# Altium project workerBoard_recovered.PrjPcb
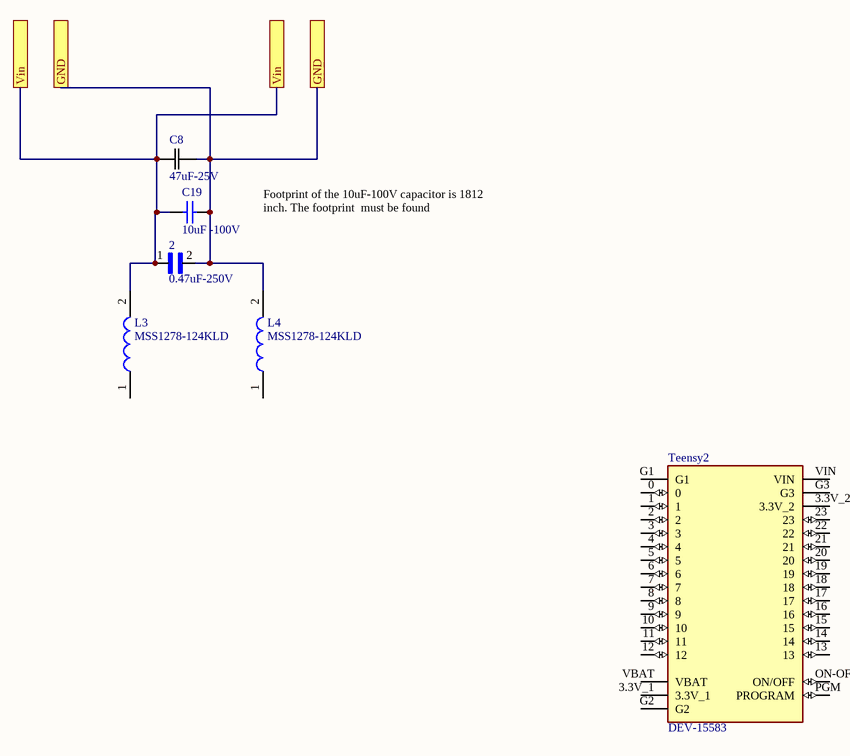
[diagram p0: masterUnit.SchDoc]
2 sheets, 11 parts. Net scope: flat (ports and power ports of the same name join across sheets).
Board files: ADC_RS_MCU.PcbDoc, accel.PcbDoc
Sheets:
  masterUnit.SchDoc
  thvd8000.SchDoc

## Sheet masterUnit.SchDoc
size A4; SheetNumber: 4; SheetTotal: 7

### Parts
2  0.47uF-250V  [CAPC3326X280N]
C8  47uF-25V
C19  value 10uF -100V  (hidden comment: Symbol)
L3  MSS1278-124KLD  [INDPM120120X805N]
L4  MSS1278-124KLD  [INDPM120120X805N]
Teensy2  DEV-15583  [MODULE_DEV-15583]

### Ports
GND, Vin

### Nets
GND: 2.2 C8.2 C19.2 L4.2 ; port GND
Vin: 2.1 C8.1 C19.1 L3.2 ; port Vin

Not connected (* = marked no-connect by the designer): L3 1; L4 1; Teensy2 0 1 2 3 3.3V_1 3.3V_2 4 5 6 7 8 9 10 11 12 13 14 15 16 17 18 19 20 21 22 23 G1 G2 G3 ON-OFF(ON/OFF) PGM(PROGRAM) VBAT VIN

### Notes on the sheet
- Footprint of the 10uF-100V capacitor is 1812 inch. The footprint  must be found

### Library data of the parts
2 = CMP-010-000002-1: MF: {'manufacturer': u'KEMET'}; MP: C1210X474KARACAUTO; Value: *; Package: None; Price: None; Availability: Unavailable; Component Type: Standard; Design Item ID: C1210X474KARACAUTO; Pin Count: 2; Source: workerBoard.SCHLIB
C8 = CMP-003-000007-1: No Description Available; Mfr_Name: Murata; Type: DEV; Copyright: Copyright (C) 2021 Ultra Librarian. All rights reserved.; Manufacturer_Part_Number: GRM31CR61E476ME44K; RefDes: RefDes; Component Type: Standard; Design Item ID: GRM31CR61E476ME44K; Pin Count: 2; Source: workerBoard.SCHLIB
C19 = CMP-003-000004-1: Capacitor; SimulationGenericComponent: True; Component Type: Standard; Design Item ID: Capacitor; Pin Count: 2; Source: workerBoard.SCHLIB
L3 L4 = CMP-006-000002-1: Inductor; Manufacturer_Name: COILCRAFT; Datasheet Link: https://componentsearchengine.com/Datasheets/1/MSS1278-124KLD.pdf; Height: 8.05mm; Manufacturer_Part_Number: MSS1278-124KLD; Component Type: Standard; Design Item ID: MSS1278-124KLD; Pin Count: 2; Source: workerBoard.SCHLIB
Teensy2 = CMP-010-000005-1: RT1062 Teensy 4.0 i.MX ARMÂ® CortexÂ®-M7 MPU Embedded Evaluation Board; MF: SparkFun Electronics; Pin Count: 33; Package: None; Digi-Key_Purchase_URL: https://www.digikey.com/product-detail/en/sparkfun-electronics/DEV-15583/1568-DEV-15583-ND/10384551?utm_source=snapeda&utm_medium=aggregator&utm_campaign=symbol; Design Item ID: DEV-15583; Component Type: Standard; MP: DEV-15583; Source: workerBoard.SCHLIB; SnapEDA_Link: https://www.snapeda.com/parts/DEV-15583/SparkFun%20Electronics/view-part/4001229/?ref=snap; Value: *; Digi-Key_Part_Number: 1568-DEV-15583-ND

## Sheet thvd8000.SchDoc
size A4; SheetNumber: 5; SheetTotal: 7
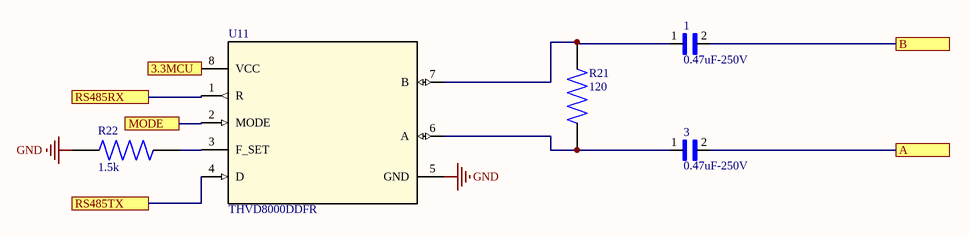
[diagram p1: thvd8000.SchDoc]

### Parts
1  0.47uF-250V  [CAPC3326X280N]
3  0.47uF-250V  [CAPC3326X280N]
R21  120  [RES_ERA3AEB121V]
R22  1.5k  [RESC1608X55N]
U11  THVD8000DDFR  [DDF0008A-IPC_A]

### Ports
3.3MCU, A, B, MODE, RS485RX, RS485TX

### Nets
GND: R22.1 U11.5(GND)
3.3MCU: U11.8(VCC) ; port 3.3MCU
A: 3.2 ; port A
B: 1.2 ; port B
MODE: U11.2(MODE) ; port MODE
RS485RX: U11.1(R) ; port RS485RX
RS485TX: U11.4(D) ; port RS485TX
Net1_1: 1.1 R21.2 U11.7(B)
Net3_1: 3.1 R21.1 U11.6(A)
NetR22_2: R22.2 U11.3(F_SET)

### Library data of the parts
1 3 = CMP-010-000002-1: MF: {'manufacturer': u'KEMET'}; MP: C1210X474KARACAUTO; Value: *; Package: None; Price: None; Availability: Unavailable; Component Type: Standard; Design Item ID: C1210X474KARACAUTO; Pin Count: 2; Source: workerBoard.SCHLIB
R21 = CMP-008-000000-1: MP: ERA3AEB121V; MF: {'manufacturer': u'Panasonic'}; Price: None; Availability: Unavailable; Value: *; Package: None; Component Type: Standard; Design Item ID: ERA3AEB121V; Pin Count: 2; Source: workerBoard.SCHLIB
R22 = CMP-008-000003-1: MP: RT0603BRD071K5L; MF: {'manufacturer': u'Yageo'}; Price: None; Availability: Unavailable; Value: *; Package: None; Component Type: Standard; Design Item ID: RT0603BRD071K5L; Pin Count: 2; Source: workerBoard.SCHLIB
U11 = CMP-010-000008-1: No Description Available; Mfr_Name: Texas Instruments; Type: DEV; RefDes: RefDes; Copyright: Copyright (C) 2021 Ultra Librarian. All rights reserved.; Manufacturer_Part_Number: THVD8000DDFR; Component Type: Standard; Design Item ID: THVD8000DDFR; Pin Count: 8; Source: workerBoard.SCHLIB